# Altium schematic sheet Poactuator_Power_Circuits.SchDoc: Sample Sheet Title
size B; Date: MM/DD/YYYY; Author: Sample Author; Organization: ORGANIZATION; Address1: ADDRESS 1; Address2: ADDRESS 2; Address3: ADDRESS 3; Address4: ADDRESS 4; Revision: -; SheetNumber: 2; SheetTotal: 6; ENG_APP_DATE: --/--/--; DSN_APP_DATE: --/--/--; CHK_APP_DATE: --/--/--
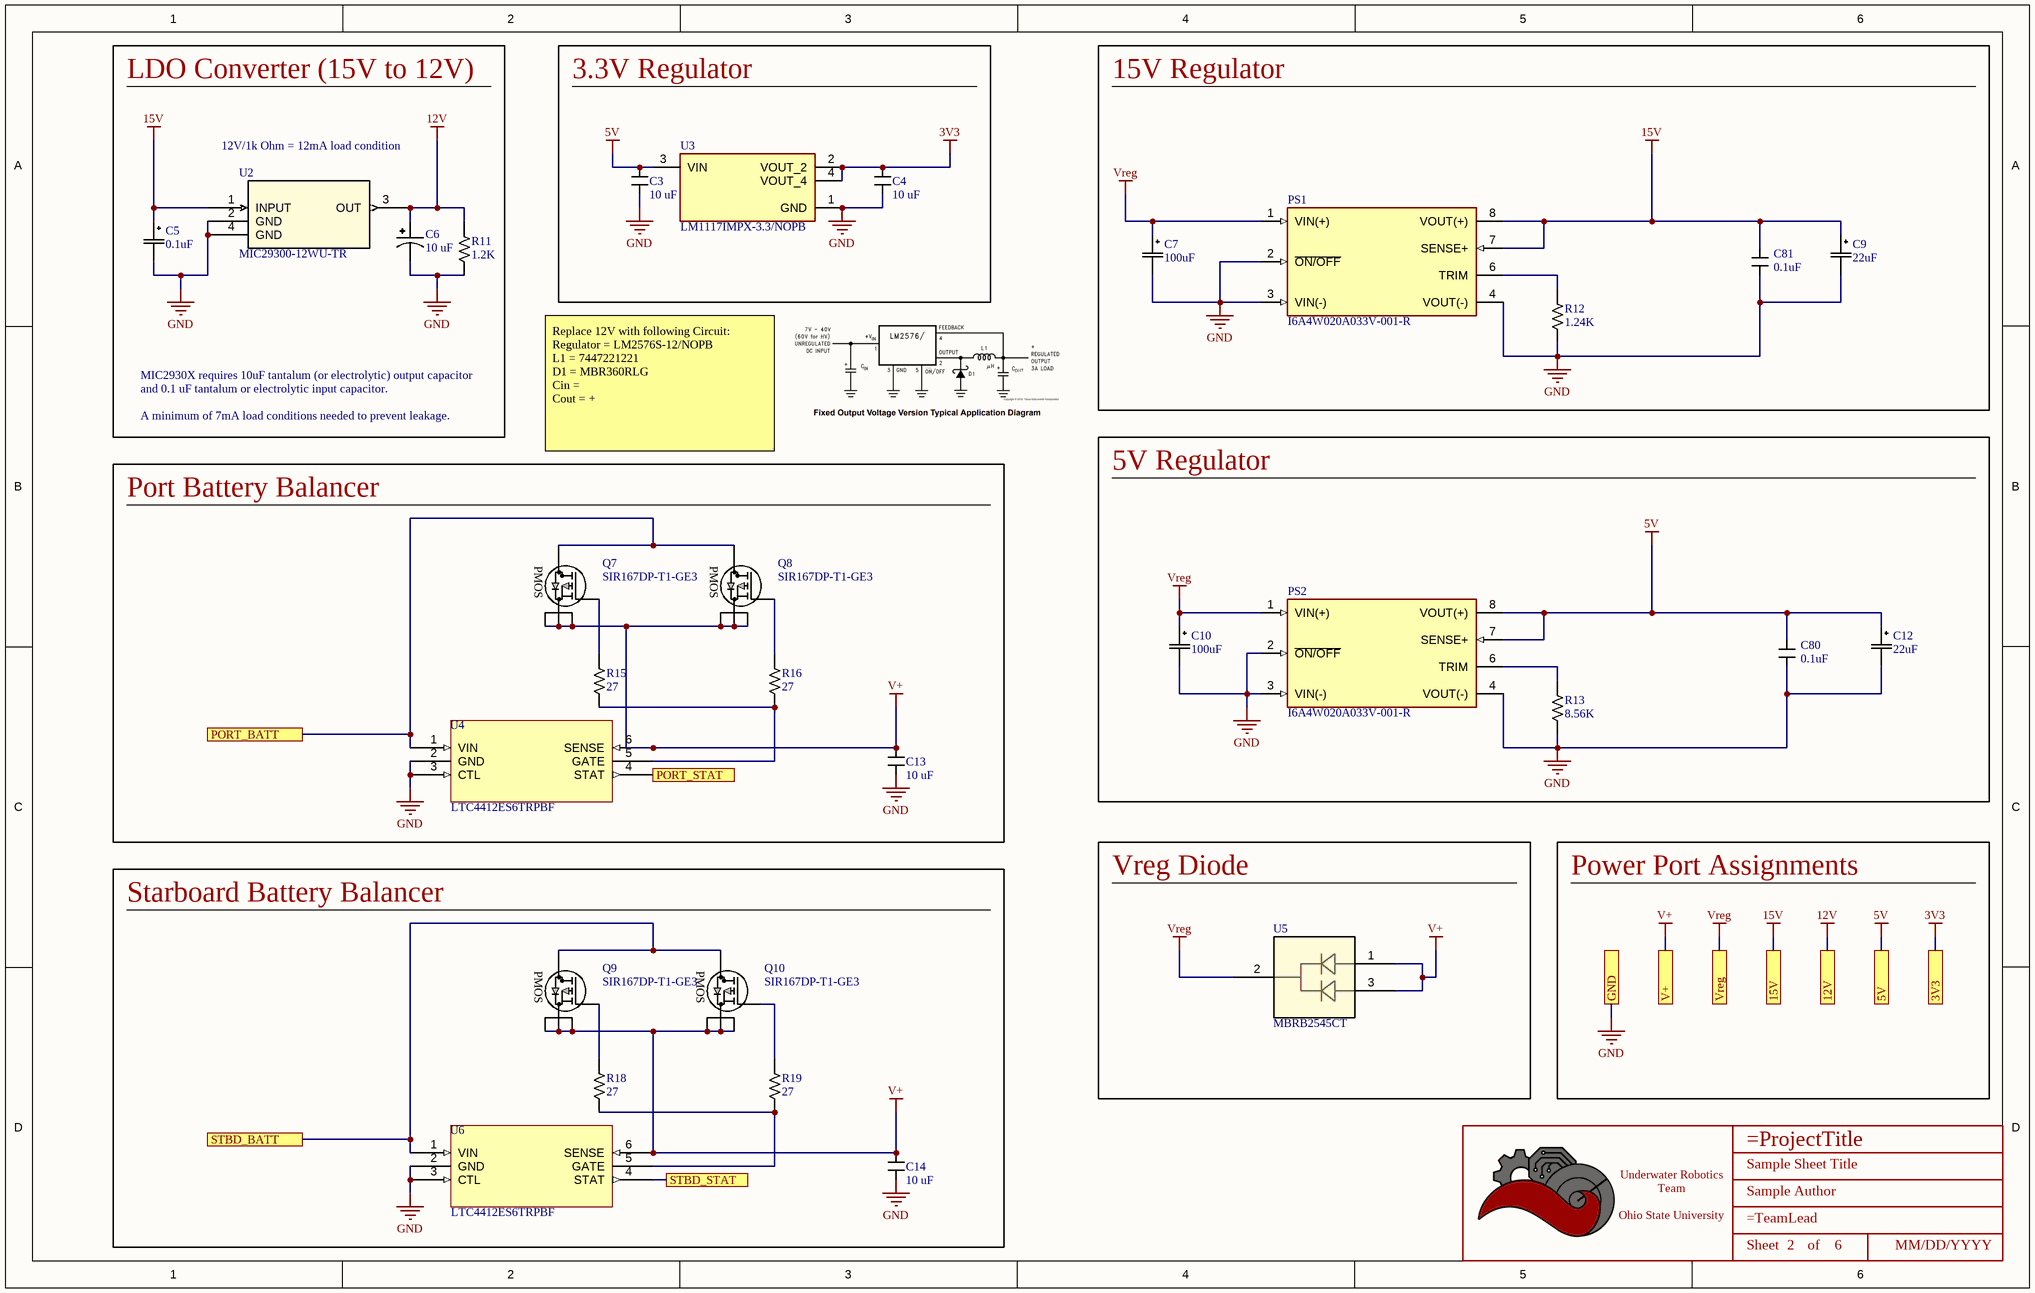
[diagram p0: Poactuator_Power_Circuits.SchDoc]

## Parts
*  Title_Block  [LOGO]  (value not drawn)  (graphical)
C3  Value (uF): 10 uF  [CAPACITOR_0603]  (hidden comment: 10uF Ceramic 6.3V)
C4  Value (uF): 10 uF  [CAPACITOR_0603]  (hidden comment: 10uF Ceramic 6.3V)
C5  value 0.1uF  [U2-D_NCH]  (hidden comment: 0.1uF electrolytic 35 V)
C6  Value (uF): 10 uF  [CAPACITOR_1206 - POLAR]  (hidden comment: 10uF Tantalum 16V)
C7  value 100uF  [PCAP_8x5.4-ELECT_NCA]  (hidden comment: 100uF electrolytic 35 V)
C9  value 22uF  [PCAP_8x5.4-ELECT_NCA]  (hidden comment: 22uF electrolytic 35 V)
C10  value 100uF  [PCAP_8x5.4-ELECT_NCA]  (hidden comment: 100uF electrolytic 35 V)
C12  value 22uF  [PCAP_8x5.4-ELECT_NCA]  (hidden comment: 22uF electrolytic 35 V)
C13  Value (uF): 10 uF  [CAPACITOR_1206]  (hidden comment: 10uF Ceramic 25V)
C14  Value (uF): 10 uF  [CAPACITOR_1206]  (hidden comment: 10uF Ceramic 25V)
C80  Capacitance: 0.1uF  [CL05A104KA5NNNC]  (hidden comment: CL05A104KA5NNNC)
C81  Capacitance: 0.1uF  [CL05A104KA5NNNC]  (hidden comment: CL05A104KA5NNNC)
PS1  I6A4W020A033V-001-R  [CONV_I6A4W020A033V-001-R]
PS2  I6A4W020A033V-001-R  [CONV_I6A4W020A033V-001-R]
Q7  SIR167DP-T1-GE3  [MOSFET_7DP-T1-GE3_VIS]
Q8  SIR167DP-T1-GE3  [MOSFET_7DP-T1-GE3_VIS]
Q9  SIR167DP-T1-GE3  [MOSFET_7DP-T1-GE3_VIS]
Q10  SIR167DP-T1-GE3  [MOSFET_7DP-T1-GE3_VIS]
R11  Value  (Ohms): 1.2K  [RESISTOR_0805]  (hidden comment: 1.2k Ohm 5% 1/2W)
R12  Value (Ohms): 1.24K  [RESISTOR_0603]  (hidden comment: RES 1.24K OHM 1% 1/10W 0603)
R13  Value (Ohms): 8.56K  [RESISTOR_0402]  (hidden comment: RES 8.56K OHM 1% 1/16W 0402)
R15  Value  (Ohms): 27  [RESISTOR_0603]  (hidden comment: 27 Ohm 5% 1/8W)
R16  Value  (Ohms): 27  [RESISTOR_0603]  (hidden comment: 27 Ohm 5% 1/8W)
R18  Value  (Ohms): 27  [RESISTOR_0603]  (hidden comment: 27 Ohm 5% 1/8W)
R19  Value  (Ohms): 27  [RESISTOR_0603]  (hidden comment: 27 Ohm 5% 1/8W)
U2  MIC29300-12WU-TR  [TO-263-3_MCH]
U3  LM1117IMPX-3.3/NOPB  [SOT-223-4]
U4  LTC4412ES6TRPBF  [TSOT-23_S6]
U5  MBRB2545CT  [D2PAK_VIS]
U6  LTC4412ES6TRPBF  [TSOT-23_S6]

## Blocks framed on the sheet
LDO Converter (15V to 12V): C5 C6 R11 U2
3.3V Regulator: C3 C4 U3
15V Regulator: C7 C9 C81 PS1 R12
5V Regulator: C10 C12 C80 PS2 R13
Port Battery Balancer: C13 Q7 Q8 R15 R16 U4
Starboard Battery Balancer: C14 Q9 Q10 R18 R19 U6
Vreg Diode: U5

## Ports
3V3, 5V, 12V, 15V, GND, PORT_BATT, PORT_STAT, STBD_BATT, STBD_STAT, V+, Vreg

## Nets
3V3: C4.1 U3.2(VOUT_2) U3.4(VOUT_4) ; port 3V3
5V: C3.1 C12.1 C80.1 PS2.7(SENSE+) PS2.8(VOUT(+)) U3.3(VIN) ; port 5V
12V: C6.1 R11.1 U2.3(OUT) ; port 12V
15V: C5.1 C9.1 C81.1 PS1.7(SENSE+) PS1.8(VOUT(+)) U2.1(INPUT) ; port 15V
GND: C3.2 C4.2 C5.2 C6.2 C7.2 C9.2 C10.2 C12.2 C13.2 C14.2 C80.2 C81.2 PS1.2(~{ON/OFF}) PS1.3(VIN(-)) PS1.4(VOUT(-)) PS2.2(~{ON/OFF}) PS2.3(VIN(-)) PS2.4(VOUT(-)) R11.2 R12.2 R13.2 U2.2(GND) U2.4(GND) U3.1(GND) U4.2(GND) U4.3(CTL) U6.2(GND) U6.3(CTL) ; port GND
V+: C13.1 C14.1 Q7.1(S) Q7.2(S) Q7.3(S) Q8.1(S) Q8.2(S) Q8.3(S) Q9.1(S) Q9.2(S) Q9.3(S) Q10.1(S) Q10.2(S) Q10.3(S) U4.6(SENSE) U5.1 U5.3 U6.6(SENSE) ; port V+
Vreg: C7.1 C10.1 PS1.1(VIN(+)) PS2.1(VIN(+)) U5.2 ; port Vreg
PORT_BATT: Q7.D Q8.D U4.1(VIN) ; port PORT_BATT
PORT_STAT: U4.4(STAT) ; port PORT_STAT
STBD_BATT: Q9.D Q10.D U6.1(VIN) ; port STBD_BATT
STBD_STAT: U6.4(STAT) ; port STBD_STAT
NetPS1_6: PS1.6(TRIM) R12.1
NetPS2_6: PS2.6(TRIM) R13.1
NetQ7_4: Q7.4(G) R15.1
NetQ8_4: Q8.4(G) R16.1
NetQ9_4: Q9.4(G) R18.1
NetQ10_4: Q10.4(G) R19.1
NetR15_2: R15.2 R16.2 U4.5(GATE)
NetR18_2: R18.2 R19.2 U6.5(GATE)

## Notes on the sheet
- 12V/1k Ohm = 12mA load condition
- MIC2930X requires 10uF tantalum (or electrolytic) output capacitor
- and 0.1 uF tantalum or electrolytic input capacitor.
- A minimum of 7mA load conditions needed to prevent leakage.
- Replace 12V with following Circuit:
  Regulator = LM2576S-12/NOPB
  L1 = 7447221221
  D1 = MBR360RLG
  Cin =
  Cout = +
- Power Port Assignments
- DWG. NO.
- REV.
- SHT.
- THIS DOCUMENT AND THE DATA DISCLOSED HEREIN OR HEREWITH IS THE PROPERTY OF ALTIUM LIMITED AND MAY BE FREELY DISTRIBUTED IN WHOLE. NO RIGHTS ARE RESERVED OR EXPRESS OR IMPLIED WARANTEE GIVEN.
- REVISION
- DESCRIPTION
- DATE
- APPROVED
- ENG:
- APPROVALS
- PROJECT
- DSN:
- CHK:
- REFERENCE DOCUMENTS
- PROJECT REVISION:
- TITLE
- DOCUMENT REVISION:
- DESIGN ITEM:
- BOM:
- FAB DWG:
- PCB DWG:
- ASSY DWG:
- SCALE:
- SIZE
- B
- CAGE CODE
- FILE NAME
- DWG NO.
- SHEET
- OF
- REV
- (in symbol SIR167DP-T1-GE3) PMOS
- (in symbol Title_Block) Underwater Robotics Team / Ohio State University; Sheet; of

## Library data of the parts
* = Title_Block: UWRT Schematic Title Block Template / Created June 2021, Dylan Trainor
C3 C4 = CAPACITOR_10uF_0603: Cap 10uF 6.3V +/-20% / Ceramic 0603; Made By: Flip B; ComponentLink1Description: Digikey; ComponentLink1URL: https://www.digikey.com/en/products/detail/samsung-electro-mechanics/CL10A106MQ8NNNC/3886777; Supplier 1: Digi-Key; Supplier Part Number 1: 1276-1119-1-ND; Tolerance: +/- 20%; Voltage: 6.3V
C5 = CAP ALUM 0.1UF 20% 35V SMD: 0.1 µF 35 V Aluminum Electrolytic Capacitors Radial, Can - SMD 7000 Hrs @ 105°C; Mfr_Name: Nichicon; Manufacturer_Part_Number: UCB1V0R1MCL1GS; Type: DEV; Made by: Tyson Nguyen; Copyright: Copyright (C) 2022 Ultra Librarian. All rights reserved.; RefDes: RefDes; Supplier 1: Digi-Key; Supplier Part Number 1: 493-9956-1-ND
C6 = CAPACITOR_10uF_1206_Tantalum_1: Cap 10uF 16V +/-20% / Tantalum 1206; Tolerance: +/- 10%; Made By: Dylan T; ComponentLink1Description: Digikey; ComponentLink1URL: https://www.digikey.com/en/products/detail/kyocera-avx/F981A106MMA/4004990; Voltage: 16V; Supplier 1: Newark; Supplier Part Number 1: 26AC4143
C7 C10 = CAP ALUM 100UF 20% 35V SMD: 100 µF 35 V Aluminum Electrolytic Capacitors Radial, Can - SMD 1000 Hrs; Mfr_Name: Nichicon; Manufacturer_Part_Number: UCB1V0R1MCL1GS; Type: DEV; Made by: Tyson Nguyen; Copyright: Copyright (C) 2022 Ultra Librarian. All rights reserved.; RefDes: RefDes; Supplier 1: Mouser; Supplier Part Number 1: 667-EEE-1VA101XP
C9 C12 = CAP ALUM 22UF 20% 35V SMD: 22 µF 35 V Aluminum Electrolytic Capacitors Radial, Can - SMD 1000 Hrs; Made by: Robert Pafford; Voltage: 35V; Supplier 1: Digi-Key; Supplier Part Number 1: PCE3952DKR-ND
C13 C14 = CAPACITOR_10uF_1206: Cap 10uF 25V +/-10% / Ceramic 1206; Made By: Robert Pafford; Tolerance: +/- 10%; Voltage: 25V; Supplier 1: Digi-Key; Supplier Part Number 1: 1276-1804-6-ND
C80 C81 = CAP CER 0.1UF 25V X5R 0402: 0.1 µF ±10% 25V Ceramic Capacitor X5R 0402 (1005 Metric); Name: Zach Ramsey; Tolerance: +/- 10%; ComponentLink1Description: Data Sheet; ComponentLink1URL: https://mm.digikey.com/Volume0/opasdata/d220001/medias/docus/503/CL05A104KA5NNNC.pdf; Rated Voltage: 25V
  C80: Supplier 1: Avnet; Supplier Part Number 1: CL05A104KA5NNNC
  C81: Supplier 1: Digikey; Supplier Part Number 1: 1276-1043-1-ND
PS1 PS2 = I6A4W020A033V-001-R: Non-Isolated PoL Module DC DC Converter 1 Output 3.3 ~ 15V 20A 9V - 53V Input; MF: TDK-Lambda Americas; Availability: In Stock; Price: None; Package: DIP-8 TDK-Lambda; MP: I6A4W020A033V-001-R; Value: *; SnapEDA_Link: https://www.snapeda.com/parts/I6A4W020A033V-001-R/TDK-Lambda%20Americas%20Inc./view-part/1737324/?ref=snap; Check_prices: https://www.snapeda.com/parts/I6A4W020A033V-001-R/TDK-Lambda%20Americas%20Inc./view-part/1737324/?ref=eda; Purchase-URL: https://pricing.snapeda.com/search/part/I6A4W020A033V-001-R/?ref=eda
Q7-Q10 = SIR167DP-T1-GE3: P-Channel 30 V 60A (Tc) 65.8W (Tc) Surface Mount PowerPAK® SO-8; Mfr_Name: Vishay; Type: DEV; Copyright: Copyright (C) 2022 Ultra Librarian. All rights reserved.; Manufacturer_Part_Number: SIR167DP-T1-GE3; RefDes: RefDes; Supplier 1: Mouser; Supplier Part Number 1: 78-SIR167DP-T1-GE3
R11 = RESISTOR_1.2K_0805: RES 1.2k OHM 5% 1/2W 0805; Tolerance: +/- 5%; Made By: Robert Pafford; Wattage: 1/2W; Supplier 1: Digi-Key; Supplier Part Number 1: P1.2KADCT-ND
R12 = RESISTOR_1.24K_1%_0603: 1.24 kOhms ±1% 0.1W, 1/10W Chip Resistor 0603 (1608 Metric) Automotive AEC-Q200 Thick Film; Tolerance: +/- 1%; Wattage: 1/10W; Created By: John Ulm; Verified By: *; Supplier 1: Digi-Key; Supplier Part Number 1: RMCF0603FT1K24CT-ND
R13 = RESISTOR_8.56K_1%_0402: 8.56 kOhms ±1% 0.063W, 1/16W Chip Resistor 0402 (1005 Metric) Automotive AEC-Q200, Moisture Resistant Metal Film; Tolerance: +/- 1%; Made By: John Ulm; Supplier 1: Digi-Key; Supplier Part Number 1: 2019-RN73H1ETTP8561F50CT-ND; Wattage: 1/16W; Verified By: *
R15 R16 R18 R19 = RESISTOR_27_0603: RES 27 OHM 5% 1/8W 0603; Tolerance: +/- 5%; Made By: Robert Pafford; ComponentLink1Description: Datasheet; ComponentLink1URL: https://www.bourns.com/docs/product-datasheets/CRxxxxx.pdf; Wattage: 1/8W; Supplier: Digikey; Digikey Part Numer: CR0603-JW-104ELFTR-ND; Supplier 1: Digi-Key; Supplier Part Number 1: 2019-RK73B1JTTD270JCT-ND
U2 = MIC29300-12WU-TR: Linear Voltage Regulator IC Positive Fixed 1 Output 3A TO-263-3; Mfr_Name: Microchip; Copyright: Copyright (C) 2022 Ultra Librarian. All rights reserved.; Manufacturer_Part_Number: MIC29300-12WU-TR; RefDes: RefDes; Type: DEV; Supplier 1: Arrow Electronics; Supplier Part Number 1: MIC29300-12WU-TR
U3 = LM1117IMPX-3.3/NOPB: 800-mA 15-V linear voltage regulator 4-SOT-223 -40 to 125; MF: Texas Instruments; Texas_Instruments-Purchase-URL: https://snapeda.com/shop?store=Texas+Instruments&id=410186; Price: None; Mouser-Purchase-URL: https://snapeda.com/shop?store=Mouser&id=410186; MP: LM1117IMPX-3.3/NOPB; Value: *; Availability: Good; Package: SOT-223-4 Texas Instruments; Arrow_Electronics-Purchase-URL: https://snapeda.com/shop?store=Arrow+Electronics&id=410186; SnapEDA_Link: https://www.snapeda.com/parts/LM1117IMPX-3.3/NOPB/Texas%20Instruments/view-part/410186/?ref=snap; DigiKey-Purchase-URL: https://snapeda.com/shop?store=DigiKey&id=410186
U4 U6 = LTC4412ES6TRPBF: OR Controller Source Selector Switch P-Channel 2:1 TSOT-23-6; MP: LTC4412ES6#TRPBF; MF: Analog Devices; Price: None; Availability: Good; Mouser-Purchase-URL: https://snapeda.com/shop?store=Mouser&id=4343773; Arrow_Europe-Purchase-URL: https://snapeda.com/shop?store=Arrow+Europe&id=4343773; DigiKey-Purchase-URL: https://snapeda.com/shop?store=DigiKey&id=4343773; Package: SOT-23-6 Analog Devices; SnapEDA_Link: https://www.snapeda.com/parts/LTC4412ES6%23TRPBF/Analog%20Devices/view-part/4343773/?ref=snap; Value: *; Check_prices: https://www.snapeda.com/parts/LTC4412ES6%23TRPBF/Analog%20Devices/view-part/4343773/?ref=eda; Supplier 1: Mouser; Supplier Part Number 1: 584-LTC4412ES6#TRPBF
U5 = MBRB2545CT: Diode Array 1 Pair Common Cathode 45 V Surface Mount TO-263-3, D²Pak (2 Leads + Tab), TO-263AB; Mfr_Name: Vishay; Copyright: Copyright (C) 2023 Ultra Librarian. All rights reserved.; Manufacturer_Part_Number: MBRB2545CT; RefDes: RefDes; Type: DEV; ComponentLink1Description: Supplier Link; ComponentLink1URL: https://www.digikey.com/en/products/detail/smc-diode-solutions/MBRB2545CT/6022901